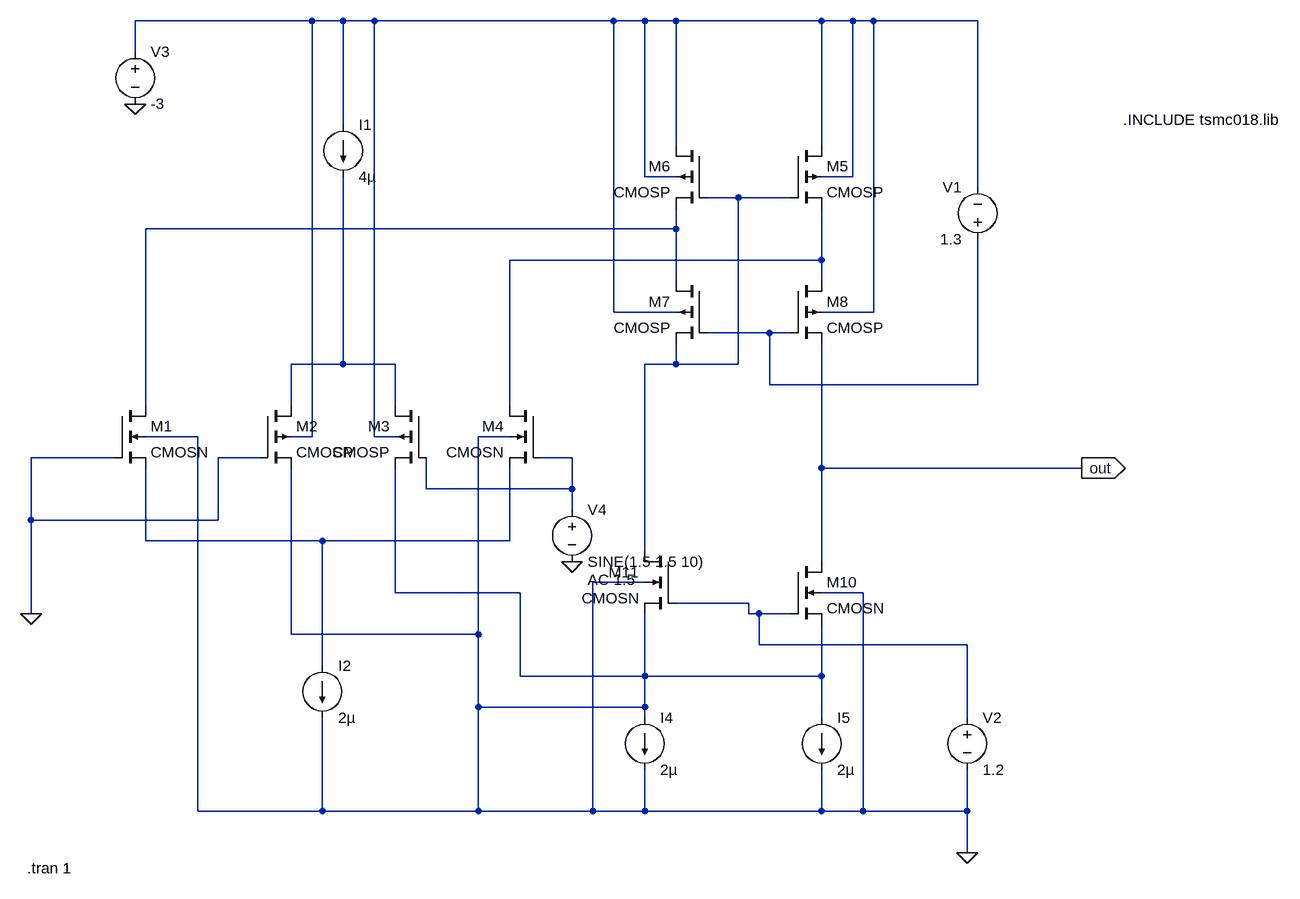
[diagram p0: schematic input rail to rail.asc]
input rail to rail.asc, the LTspice schematic file:
Version 4
SHEET 1 1684 872
WIRE 176 -448 -96 -448
WIRE 224 -448 176 -448
WIRE 272 -448 224 -448
WIRE 640 -448 272 -448
WIRE 688 -448 640 -448
WIRE 736 -448 688 -448
WIRE 960 -448 736 -448
WIRE 1008 -448 960 -448
WIRE 1040 -448 1008 -448
WIRE 1200 -448 1040 -448
WIRE -96 -400 -96 -448
WIRE 224 -288 224 -448
WIRE 736 -256 736 -448
WIRE 960 -256 960 -448
WIRE 688 -208 688 -448
WIRE 736 -208 688 -208
WIRE 1008 -208 1008 -448
WIRE 1008 -208 960 -208
WIRE 1200 -192 1200 -448
WIRE 832 -176 784 -176
WIRE 912 -176 832 -176
WIRE 736 -128 736 -160
WIRE 736 -128 -80 -128
WIRE 960 -80 960 -160
WIRE 960 -80 480 -80
WIRE 736 -48 736 -128
WIRE 960 -48 960 -80
WIRE 640 0 640 -448
WIRE 736 0 640 0
WIRE 1040 0 1040 -448
WIRE 1040 0 960 0
WIRE 880 32 784 32
WIRE 912 32 880 32
WIRE 224 80 224 -208
WIRE 224 80 144 80
WIRE 304 80 224 80
WIRE 736 80 736 48
WIRE 736 80 688 80
WIRE 832 80 832 -176
WIRE 832 80 736 80
WIRE 880 112 880 32
WIRE 1200 112 1200 -112
WIRE 1200 112 880 112
WIRE -80 144 -80 -128
WIRE 144 144 144 80
WIRE 304 144 304 80
WIRE 480 144 480 -80
WIRE 0 192 -80 192
WIRE 176 192 176 -448
WIRE 176 192 144 192
WIRE 272 192 272 -448
WIRE 304 192 272 192
WIRE 480 192 432 192
WIRE -128 224 -256 224
WIRE 96 224 32 224
WIRE 576 224 528 224
WIRE 960 240 960 48
WIRE 1360 240 960 240
WIRE 352 272 352 224
WIRE 576 272 576 224
WIRE 576 272 352 272
WIRE 576 304 576 272
WIRE -256 320 -256 224
WIRE 32 320 32 224
WIRE 32 320 -256 320
WIRE -80 352 -80 240
WIRE 192 352 -80 352
WIRE 480 352 480 240
WIRE 480 352 192 352
WIRE 688 368 688 80
WIRE 960 384 960 240
WIRE 688 416 608 416
WIRE 304 432 304 240
WIRE 496 432 304 432
WIRE 1024 432 960 432
WIRE 848 448 736 448
WIRE -256 464 -256 320
WIRE 848 464 848 448
WIRE 864 464 848 464
WIRE 912 464 864 464
WIRE 144 496 144 240
WIRE 432 496 432 192
WIRE 432 496 144 496
WIRE 864 512 864 464
WIRE 1184 512 864 512
WIRE 192 544 192 352
WIRE 496 560 496 432
WIRE 688 560 688 464
WIRE 688 560 496 560
WIRE 960 560 960 480
WIRE 960 560 688 560
WIRE 432 608 432 496
WIRE 688 608 688 560
WIRE 688 608 432 608
WIRE 688 624 688 608
WIRE 960 624 960 560
WIRE 1184 624 1184 512
WIRE 0 768 0 192
WIRE 192 768 192 624
WIRE 192 768 0 768
WIRE 432 768 432 608
WIRE 432 768 192 768
WIRE 608 768 608 416
WIRE 608 768 432 768
WIRE 688 768 688 704
WIRE 688 768 608 768
WIRE 960 768 960 704
WIRE 960 768 688 768
WIRE 1024 768 1024 432
WIRE 1024 768 960 768
WIRE 1184 768 1184 704
WIRE 1184 768 1024 768
WIRE 1184 832 1184 768
FLAG 1184 832 0
FLAG -96 -320 0
FLAG 1360 240 out
IOPIN 1360 240 Out
FLAG 576 384 0
FLAG -256 464 0
SYMBOL cmosn -128 144 R0
SYMATTR InstName M1
SYMATTR Value2 l=400n w=3000n
SYMBOL cmosp 96 144 R0
SYMATTR InstName M2
SYMATTR Value2 l=400n w=9000n
SYMBOL current 224 -288 R0
WINDOW 123 0 0 Left 0
WINDOW 39 0 0 Left 0
SYMATTR InstName I1
SYMATTR Value 4µ
SYMBOL current 192 544 R0
WINDOW 123 0 0 Left 0
WINDOW 39 0 0 Left 0
SYMATTR InstName I2
SYMATTR Value 2µ
SYMBOL current 688 624 R0
WINDOW 123 0 0 Left 0
WINDOW 39 0 0 Left 0
SYMATTR InstName I4
SYMATTR Value 2µ
SYMBOL current 960 624 R0
WINDOW 123 0 0 Left 0
WINDOW 39 0 0 Left 0
SYMATTR InstName I5
SYMATTR Value 2µ
SYMBOL voltage 1184 608 R0
WINDOW 123 0 0 Left 0
WINDOW 39 0 0 Left 0
SYMATTR InstName V2
SYMATTR Value 1.2
SYMBOL voltage 1200 -96 R180
WINDOW 0 24 96 Left 2
WINDOW 3 24 16 Left 2
WINDOW 123 0 0 Left 0
WINDOW 39 0 0 Left 0
SYMATTR InstName V1
SYMATTR Value 1.3
SYMBOL voltage -96 -416 R0
WINDOW 123 0 0 Left 0
WINDOW 39 0 0 Left 0
SYMATTR InstName V3
SYMATTR Value -3
SYMBOL cmosp 352 144 M0
SYMATTR InstName M3
SYMATTR Value2 l=400n w=9000n
SYMBOL cmosn 528 144 M0
SYMATTR InstName M4
SYMATTR Value2 l=400n w=3000n
SYMBOL cmosp 912 -256 R0
SYMATTR InstName M5
SYMATTR Value2 l=400n w=18000n
SYMBOL cmosp 784 -256 M0
SYMATTR InstName M6
SYMATTR Value2 l=400n w=18000n
SYMBOL cmosp 784 -48 M0
SYMATTR InstName M7
SYMATTR Value2 l=400n w=18000n
SYMBOL cmosp 912 -48 R0
SYMATTR InstName M8
SYMATTR Value2 l=400n w=18000n
SYMBOL cmosn 912 384 R0
SYMATTR InstName M10
SYMATTR Value2 l=400n w=10000n
SYMBOL cmosn 736 368 M0
SYMATTR InstName M11
SYMATTR Value2 l=400n w=10000n
SYMBOL voltage 576 288 R0
WINDOW 123 24 124 Left 2
WINDOW 39 0 0 Left 0
SYMATTR InstName V4
SYMATTR Value SINE(1.5 1.5 10)
SYMATTR Value2 AC 1.5
TEXT -262 856 Left 2 !.tran 1
TEXT 1424 -296 Left 2 !.INCLUDE tsmc018.lib

The netlist it stands for:
* input rail to rail.asc
M1 N003 0 N008 0 CMOSN l=400n w=3000n
M2 N006 0 0 N001 CMOSP l=400n w=9000n
I1 N001 N006 4µ
I2 N008 0 2µ
I4 0 0 2µ
I5 0 0 2µ
V2 N009 0 1.2
V1 N005 N001 1.3
V3 N001 0 -3
M3 N006 N007 0 N001 CMOSP l=400n w=9000n
M4 N004 N007 N008 0 CMOSN l=400n w=3000n
M5 N001 N002 N004 N001 CMOSP l=400n w=18000n
M6 N001 N002 N003 N001 CMOSP l=400n w=18000n
M7 N003 N005 N002 N001 CMOSP l=400n w=18000n
M8 N004 N005 out N001 CMOSP l=400n w=18000n
M10 out N009 0 0 CMOSN l=400n w=10000n
M11 N002 N009 0 0 CMOSN l=400n w=10000n
V4 N007 0 SINE(1.5 1.5 10) AC 1.5
.model NMOS NMOS
.model PMOS PMOS
.lib standard.mos
.tran 1
.INCLUDE tsmc018.lib
.backanno
.end